# Altium schematic sheet Audio.SchDoc
size A
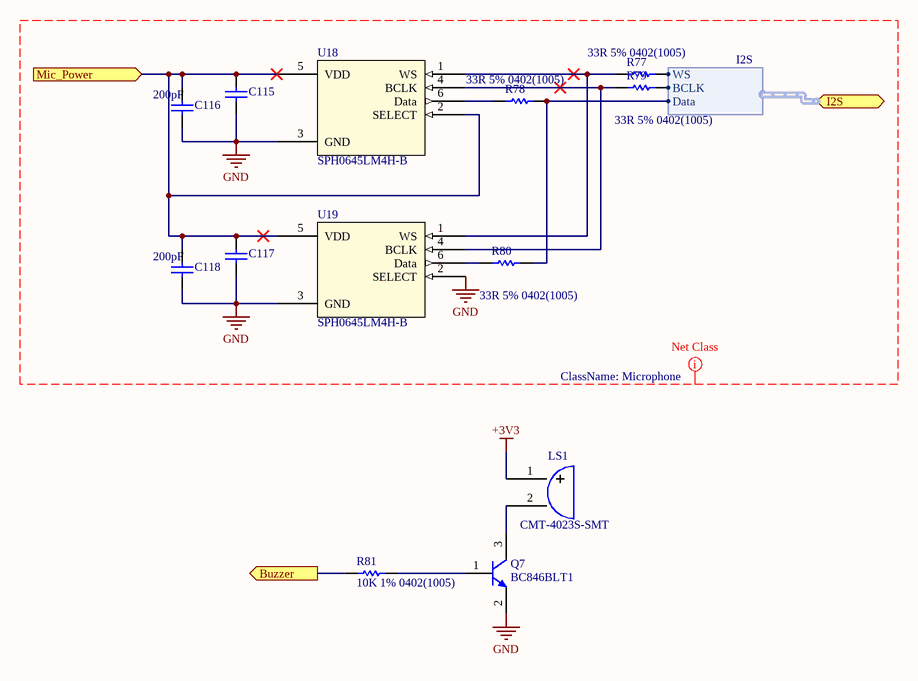
[diagram p0: Audio.SchDoc]

## Parts
C115  CAP 100nF 10V 0402(1005)  [CAPC0402(1005)60_L]  (value not drawn)
C116  value 200pF  [CAPC0402(1005)60_L]  (hidden comment: CAP 200pF 10V 0402(1005))
C117  CAP 100nF 10V 0402(1005)  [CAPC0402(1005)60_L]  (value not drawn)
C118  value 200pF  [CAPC0402(1005)60_L]  (hidden comment: CAP 200pF 10V 0402(1005))
LS1  CMT-4023S-SMT  [CMT-4023S-SMT]
Q7  BC846BLT1  [ONSC-SOT-23-3-318-08_V]
R77  33R 5% 0402(1005)  [RESC0402(1005)_M]
R78  33R 5% 0402(1005)  [RESC0402(1005)_M]
R79  33R 5% 0402(1005)  [RESC0402(1005)_M]
R80  33R 5% 0402(1005)  [RESC0402(1005)_M]
R81  10K 1% 0402(1005)  [RESC0402(1005)_L]
U18  SPH0645LM4H-B  [SPH0645LM4H-B]
U19  SPH0645LM4H-B  [SPH0645LM4H-B]

## Ports
Buzzer (out), I2S (harness I2S), Mic_Power (in)

## Harnesses
I2S: WS, BCLK, Data

## Nets
+3V3: LS1.1(+)
GND: C115.1 C116.1 C117.1 C118.1 Q7.2(E) U18.3(GND) U19.2(SELECT) U19.3(GND)
Buzzer: R81.1 ; port Buzzer
Mic_Power: C115.2 C116.2 C117.2 C118.2 U18.2(SELECT) U18.5(VDD) U19.5(VDD) ; port Mic_Power
NetLS1_2: LS1.2(-) Q7.3(C)
NetQ7_1: Q7.1(B) R81.2
NetR77_1: R77.1 U18.1(WS) U19.1(WS)
NetR77_2: R77.2 ; port I2S.WS
NetR78_1: R78.1 U18.6(Data)
NetR78_2: R78.2 R80.2 ; port I2S.Data
NetR79_1: R79.1 U18.4(BCLK) U19.4(BCLK)
NetR79_2: R79.2 ; port I2S.BCLK
NetR80_1: R80.1 U19.6(Data)

## Layout directives
net class Microphone: GND

## Library data of the parts
C115 C117 = CMP-1034-02066-1: CAP 100nF 10V ±20% 0402 (1005 Metric) Thickness 0.6mm SMD; Tolerance: Â±20%; Case-Metric: 1005; Case-EIA: 0402; Max Thickness: 0.6 mm; Rated Voltage: 10 V; Technology: SMT; Value: 100nF
C116 C118 = CMP-1034-01342-1: CAP 200pF 10V ±1% 0402 (1005 Metric) Thickness 0.6mm SMD; Case-EIA: 0402; Tolerance: Â±1%; Case-Metric: 1005; Technology: SMT; Rated Voltage: 10 V; Max Thickness: 0.6 mm
LS1 = CMT-4023S-SMT: Buzzer
Q7 = CMP-1048-00761-1: General Purpose Transistor, NPN Silicon, 3-Pin SOT-23, Tape and Reel; Manufacturer: On Semiconductor; IC Continuous (A): 0.1; fT Min (MHz): 100; RoHS: FALSE; Mounting Technology: Surface Mount; ComponentLink3Description: Package Specification; DatasheetVersion: Rev. 11; Polarity: NPN; PackageDescription: 3-Pin Small Outline Transistor, Body 2.92 x 1.3 mm, Pitch 0.95 mm; ComponentLink3URL: http://www.onsemi.cn/pub_link/Collateral/318-08.PDF; ComponentLink1Description: Manufacturer URL; ComponentLink2Description: Datasheet; PackageVersion: Rev. AP, 11/2009; ComponentLink2URL: http://www.onsemi.cn/pub_link/Collateral/BC846ALT1-D.PDF; Packing: Tape and Reel; PartNumber: BC846BLT1; ComponentLink1URL: http://www.onsemi.com/; PackageReference: SOT-23-3-318-08
R77-R80 = CMP-1011-00038-1: 33R 0.063W 5% 0402 (1005 Metric)  SMD; Case-EIA: 0402; Case-Metric: 1005; Value: 33.00 Ohm; Technology: SMT; Tolerance: 5 %; Power: 0.063 W
R81 = CMP-1011-00623-1: 10K 0.063W 1% 0402 (1005 Metric)  SMD; Case-EIA: 0402; Value: 10000.00 Ohm; Case-Metric: 1005; Technology: SMT; Tolerance: 1 %; Power: 0.063 W